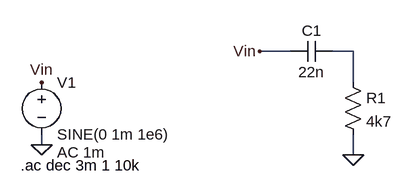
[diagram p0: schematic stage-3-HPF-DC-Blocker.asc]
stage-3-HPF-DC-Blocker.asc, the LTspice schematic file:
Version 4
SHEET 1 880 680
WIRE 192 80 144 80
WIRE 288 80 256 80
WIRE 288 128 288 80
WIRE -192 224 -192 208
WIRE 288 240 288 208
FLAG 288 240 0
FLAG 144 80 Vin
FLAG -192 128 Vin
FLAG -192 224 0
SYMBOL voltage -192 112 R0
WINDOW 123 24 124 Left 2
WINDOW 39 0 0 Left 0
SYMATTR Value2 AC 1m
SYMATTR InstName V1
SYMATTR Value SINE(0 1m 1e6)
SYMBOL cap 256 64 R90
WINDOW 0 0 32 VBottom 2
WINDOW 3 32 32 VTop 2
SYMATTR InstName C1
SYMATTR Value 22n
SYMBOL res 272 112 R0
SYMATTR InstName R1
SYMATTR Value 4k7
TEXT -224 256 Left 2 !.ac dec 3m 1 10k

The netlist it stands for:
* stage-3-HPF-DC-Blocker.asc
V1 Vin 0 SINE(0 1m 1e6) AC 1m
C1 N001 Vin 22n
R1 N001 0 4k7
.ac dec 3m 1 10k
.backanno
.end